# Altium schematic sheet 408HR_pcbminions.SchDoc
size OrCAD E
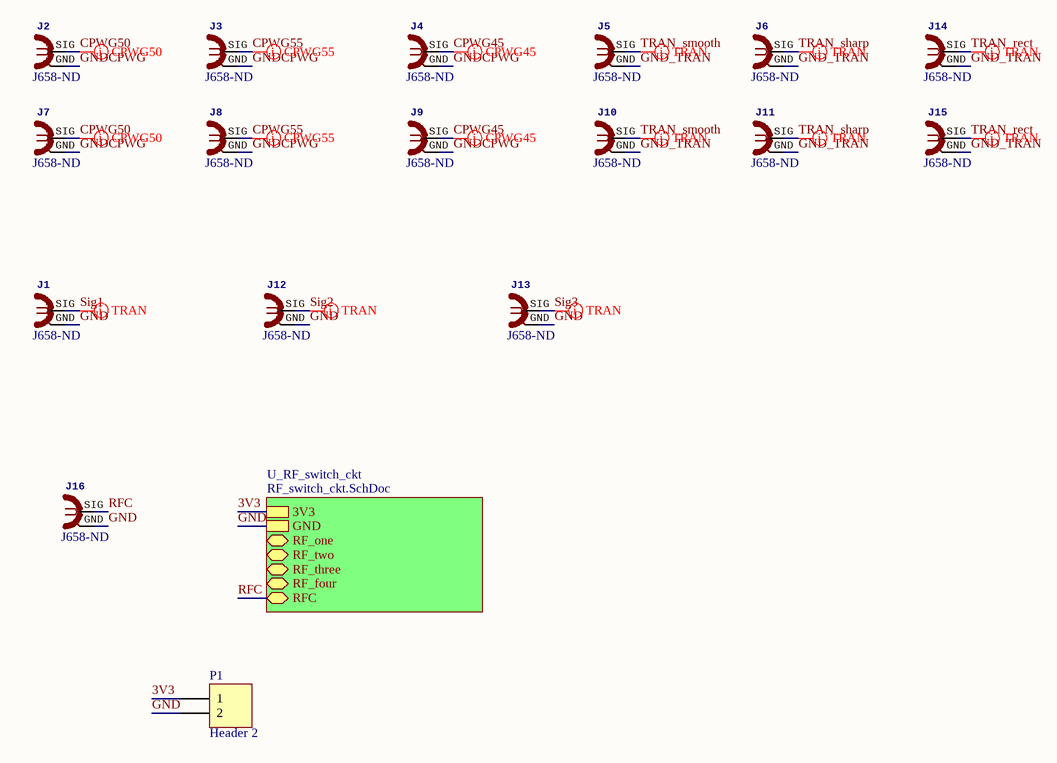
[diagram p0: 408HR_pcbminions.SchDoc]

## Parts
J1  Supplier Part Number 1: J658-ND  [SMA-OSHPARK-4L-1.6MM- ALT3]  (hidden comment: SMA 50 Ohm edge)
J2  Supplier Part Number 1: J658-ND  [SMA-OSHPARK-4L-1.6MM- ALT3]  (hidden comment: SMA 50 Ohm edge)
J3  Supplier Part Number 1: J658-ND  [SMA-OSHPARK-4L-1.6MM- ALT3]  (hidden comment: SMA 50 Ohm edge)
J4  Supplier Part Number 1: J658-ND  [SMA-OSHPARK-4L-1.6MM- ALT3]  (hidden comment: SMA 50 Ohm edge)
J5  Supplier Part Number 1: J658-ND  [SMA-OSHPARK-4L-1.6MM- ALT3]  (hidden comment: SMA 50 Ohm edge)
J6  Supplier Part Number 1: J658-ND  [SMA-OSHPARK-4L-1.6MM- ALT3]  (hidden comment: SMA 50 Ohm edge)
J7  Supplier Part Number 1: J658-ND  [SMA-OSHPARK-4L-1.6MM- ALT3]  (hidden comment: SMA 50 Ohm edge)
J8  Supplier Part Number 1: J658-ND  [SMA-OSHPARK-4L-1.6MM- ALT3]  (hidden comment: SMA 50 Ohm edge)
J9  Supplier Part Number 1: J658-ND  [SMA-OSHPARK-4L-1.6MM- ALT3]  (hidden comment: SMA 50 Ohm edge)
J10  Supplier Part Number 1: J658-ND  [SMA-OSHPARK-4L-1.6MM- ALT3]  (hidden comment: SMA 50 Ohm edge)
J11  Supplier Part Number 1: J658-ND  [SMA-OSHPARK-4L-1.6MM- ALT3]  (hidden comment: SMA 50 Ohm edge)
J12  Supplier Part Number 1: J658-ND  [SMA-OSHPARK-4L-1.6MM- ALT3]  (hidden comment: SMA 50 Ohm edge)
J13  Supplier Part Number 1: J658-ND  [SMA-OSHPARK-4L-1.6MM- ALT3]  (hidden comment: SMA 50 Ohm edge)
J14  Supplier Part Number 1: J658-ND  [SMA-OSHPARK-4L-1.6MM- ALT3]  (hidden comment: SMA 50 Ohm edge)
J15  Supplier Part Number 1: J658-ND  [SMA-OSHPARK-4L-1.6MM- ALT3]  (hidden comment: SMA 50 Ohm edge)
J16  Supplier Part Number 1: J658-ND  [SMA-OSHPARK-4L-1.6MM- ALT3]  (hidden comment: SMA 50 Ohm edge)
P1  Header 2  [HDR1X2]

## Sub-sheets
U_RF_switch_ckt = RF_switch_ckt.SchDoc: 3V3, GND, RF_one (bidir), RF_two (bidir), RF_three (bidir), RF_four (bidir), RFC (bidir)

## Nets
3V3: P1.1 ; sheet U_RF_switch_ckt/3V3
CPWG45: J4.SIG J9.SIG
CPWG50: J2.SIG J7.SIG
CPWG55: J3.SIG J8.SIG
GND: J1.GND J12.GND J13.GND J16.GND P1.2 ; sheet U_RF_switch_ckt/GND
GND_TRAN: J5.GND J6.GND J10.GND J11.GND J14.GND J15.GND
GNDCPWG: J2.GND J3.GND J4.GND J7.GND J8.GND J9.GND
RFC: J16.SIG ; sheet U_RF_switch_ckt/RFC
Sig1: J1.SIG
Sig2: J12.SIG
Sig3: J13.SIG
TRAN_rect: J14.SIG J15.SIG
TRAN_sharp: J6.SIG J11.SIG
TRAN_smooth: J5.SIG J10.SIG

## Layout directives
rule Impedance Constraint [Min = 50.00    Max = 50.00    ]; rule Clearance Constraint [Clearance = 10mil]; rule Width Constraint [Pref Width = 13.72mil    Min Width = 13.72mil    Max Width = 13.72mil]: CPWG50
rule Impedance Constraint [Min = 45.00    Max = 45.00    ]; rule Clearance Constraint [Clearance = 10mil]; rule Width Constraint [Pref Width = 16.41mil    Min Width = 16.41mil    Max Width = 16.41mil]: CPWG45
rule Impedance Constraint [Min = 55.00    Max = 55.00    ]; rule Clearance Constraint [Clearance = 10mil]; rule Width Constraint [Pref Width = 11.55mil    Min Width = 11.55mil    Max Width = 11.55mil]: CPWG55
rule Width Constraint [Pref Width = 13.72mil    Min Width = 13.72mil    Max Width = 13.72mil]; rule Clearance Constraint [Clearance = 10mil]: TRAN_smooth
rule Width Constraint [Pref Width = 13.72mil    Min Width = 13.72mil    Max Width = 97.138mil]; rule Clearance Constraint [Clearance = 10mil]: Sig1, Sig3, TRAN_sharp, TRAN_smooth
rule Width Constraint [Pref Width = 13.72mil    Min Width = 13.72mil    Max Width = 97.138mil]; rule Clearance Constraint [Generic clearance = 10mil, and 3 value(s) for objects]: TRAN_rect
rule Width Constraint [Pref Width = 13.72mil    Min Width = 13.72mil    Max Width = 97.138mil]; rule Clearance Constraint [Generic clearance = 10mil, and 2 value(s) for objects]: TRAN_rect
rule Width Constraint [Pref Width = 13.72mil    Min Width = 13.72mil    Max Width = 97.138mil]; rule Clearance Constraint [Generic clearance = 10mil, and 6 value(s) for objects]: Sig2

## Library data of the parts
J1-J16 = SMA-OSHPARK-4L-1.6MM-ALT3: GateName_1: G1; SymbolName_1: COAX; DeviceName: -OSHPARK-4L-1.6MM; LibraryName: dword1511-connectors; DeviceSetName: SMA; Package: SMA-OSHPARK-4L-1.6MM; Supplier 1: Digi-Key
P1 = Header 2: Header, 2-Pin; LatestRevisionDate: 17-Jul-2002; LatestRevisionNote: Re-released for DXP Platform.; Publisher: Altium Limited